# Altium schematic sheet RTC_Block.SchDoc
size A4; CheckedBy: CT-Energys; Author: CT-Energys; CompanyName: HTD COMPANY LIMITED; DrawnBy: CHITOAN; Engineer: CHITOAN; Organization: Altium Limited; Address1: HO CHI MINH CITY; Address2: VIETNAM
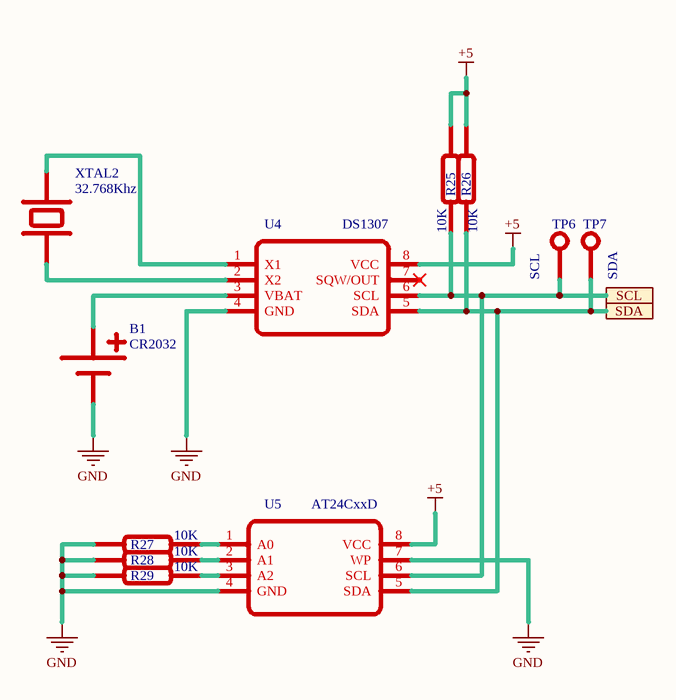
[diagram p0: RTC_Block.SchDoc]

## Parts
B1  CR2032  [CR2032-SMD-Thick]
R25  10K  [R0603]
R26  10K  [R0603]
R27  10K  [R0603]
R28  10K  [R0603]
R29  10K  [R0603]
TP6  SCL  [Test Point]
TP7  SDA  [Test Point]
U4  DS1307  [SOIC8]
U5  AT24CxxD  [SOIC8]
XTAL2  32.768Khz  [CRYSTAL DT38]

## Ports
SCL, SDA

## Nets
+5: R25.2 R26.2 U4.8(VCC) U5.8(VCC)
GND: B1.2 R27.1 R28.1 R29.1 U4.4(GND) U5.4(GND) U5.7(WP)
SCL: R25.1 TP6.1 U4.6(SCL) U5.6(SCL) ; port SCL
SDA: R26.1 TP7.1 U4.5(SDA) U5.5(SDA) ; port SDA
NetB1_1: B1.1 U4.3(VBAT)
NetR27_2: R27.2 U5.1(A0)
NetR28_2: R28.2 U5.2(A1)
NetR29_2: R29.2 U5.3(A2)
NetU4_1: U4.1(X1) XTAL2.1
NetU4_2: U4.2(X2) XTAL2.2

Not connected (* = marked no-connect by the designer): U4 7(SQW/OUT)*

## Notes on the sheet
- Title
- Size:
- Date:
- A4
- Number:
- Time:
- Revision:
- Design by:
- Company:
- File:

## Library data of the parts
B1 = CR2032: CR2032 Battery; ComponentLink1Description: CR2032 Battery; ComponentLink1URL: https://www.jauch.com/downloadfile/5ef1edcfd15cf1c9921d36c851eb4c34f/cr2032_jauch.pdf%C2%A0
R25-R29 = Resistor
TP6 TP7 = TestPoint: Test Point
U4 = DS1307: Realtime Clock IC; ComponentLink1Description: DS1307; ComponentLink1URL: https://www.alldatasheet.com/datasheet-pdf/view/254791/MAXIM/DS1307.html
U5 = AT24CxxD: I2C Serial EEPROM; ComponentLink1Description: AT24CS02; ComponentLink1URL: https://ww1.microchip.com/downloads/aemDocuments/documents/MPD/ProductDocuments/DataSheets/20006330A.pdf
XTAL2 = CRYSTAL-2P: Crystall 2Pin Capacitor Intergrated